# EAGLE design avoccado-avr-pcb (EAGLE 7.2.0)
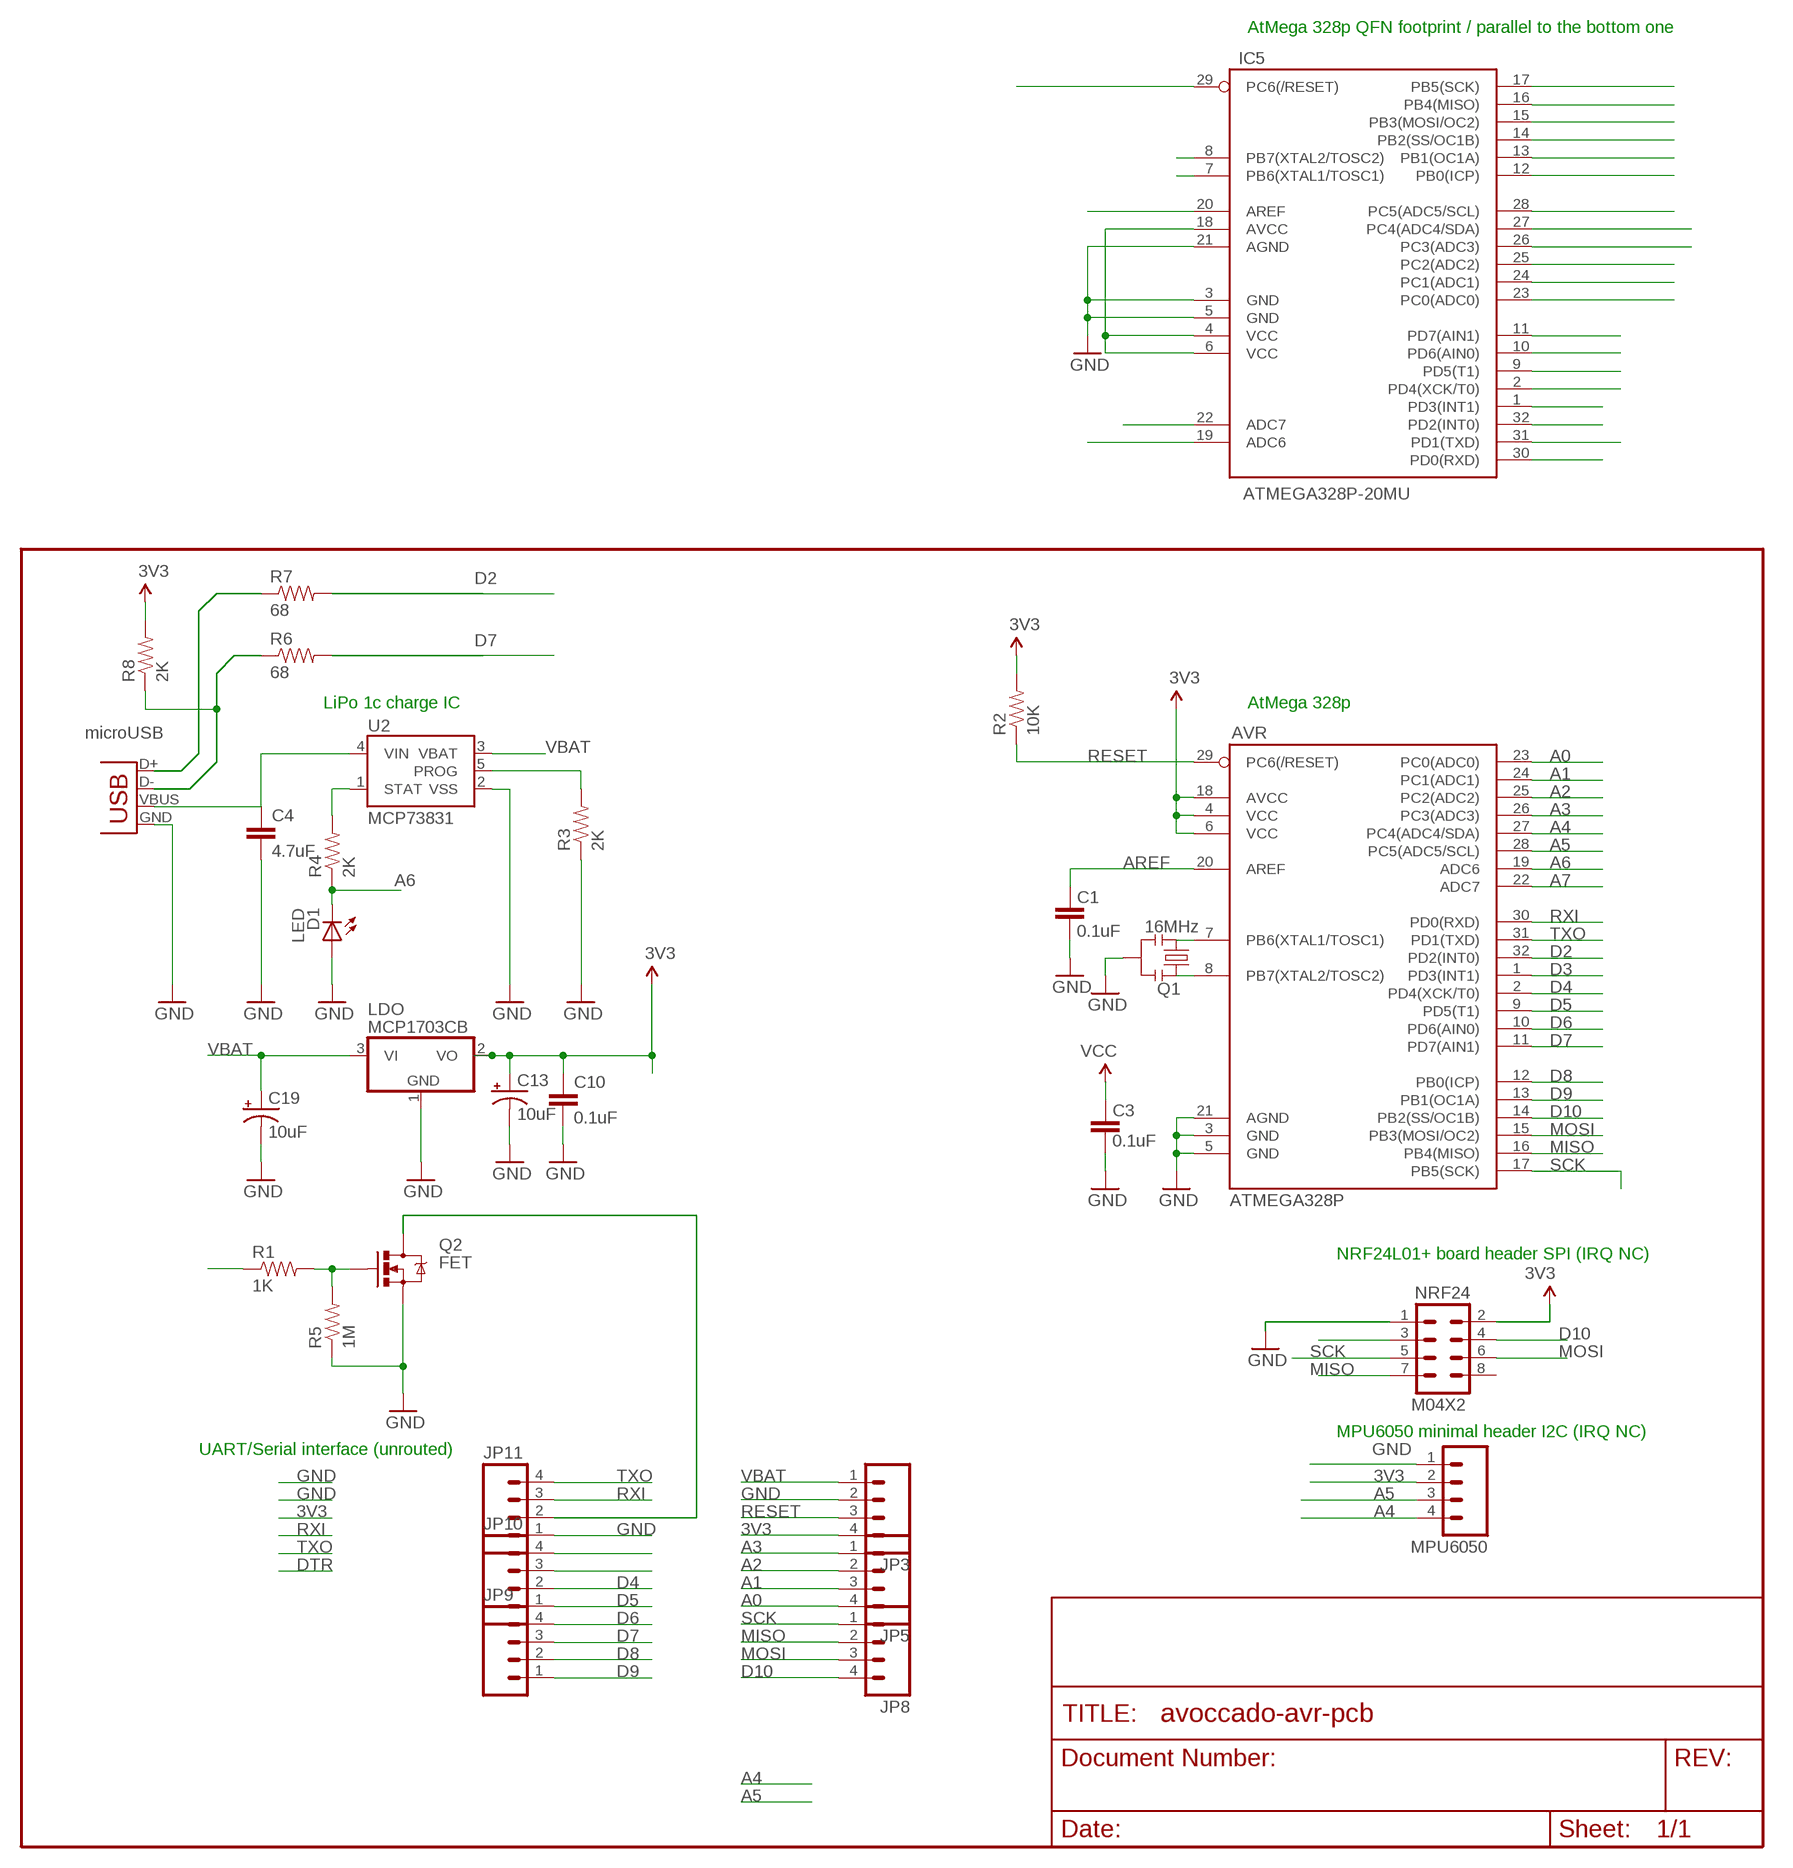
[diagram p0: schematic, sheet 1]

## Parts
AVR  ATMEGA328P  ATMEGA328_SMT  [TQFP32-08]
C1  0.1uF  CAP0402  [C0402]
C3  0.1uF  CAP0402  [C0402]
C4  4.7uF  4.7UF-6.3V-10%(0603)0603  [0603-CAP]
C10  0.1uF  CAP0402  [C0402]
C13  10uF  CAP_POL1206  [EIA3216]
C19  10uF  CAP_POL1206  [EIA3216]
D1  LED  LED0603  [LED-0603]
IC5  ATMEGA328P-20MU  MEGA8-MI  [MLF32]
JP3  M04SMD1X4  [1X04-SMD]
JP5  M04SMD1X4  [1X04-SMD]
JP8  M04SMD1X4  [1X04-SMD]
JP9  M04SMD1X4  [1X04-SMD]
JP10  M04SMD1X4  [1X04-SMD]
JP11  M04SMD1X4  [1X04-SMD]
LDO  MCP1703CB  [SOT23]
MPU6050  M041X04_NO_SILK  [1X04_NO_SILK]
NRF24  M04X2  [2X4]
Q1  16MHz  RESONATORSMD  [RESONATOR-SMD]
Q2  FET  MOSFET-NCHANNEL2N7002PW  [SOT323]
R1  1K  RESISTOR0603  [0603-RES]
R2  10K  RESISTOR0603  [0603-RES]
R3  2K  RESISTOR0603  [0603-RES]
R4  2K  RESISTOR0603  [0603-RES]
R5  1M  RESISTOR0603  [0603-RES]
R6  68  RESISTOR0603  [0603-RES]
R7  68  RESISTOR0603  [0603-RES]
R8  2K  RESISTOR0603  [0603-RES]
U2  MCP73831  [SOT23-5]
X1  Micro USB  USB-MICROB  [USB-MICROB]

## Nets
3V3: AVR.4(VCC) AVR.6(VCC) AVR.18(AVCC) C3.2 C10.1 C13.A(+) IC5.4(VCC) IC5.6(VCC) IC5.18(AVCC) JP3.4 LDO.2(VO) MPU6050.2 NRF24.2 R2.2 R8.2 ; supply symbol labelled VCC
A0: AVR.23(PC0(ADC0)) IC5.23(PC0(ADC0)) JP5.4
A1: AVR.24(PC1(ADC1)) IC5.24(PC1(ADC1)) JP5.3
A2: AVR.25(PC2(ADC2)) IC5.25(PC2(ADC2)) JP5.2
A3: AVR.26(PC3(ADC3)) IC5.26(PC3(ADC3)) JP5.1
A4: AVR.27(PC4(ADC4/SDA)) IC5.27(PC4(ADC4/SDA)) MPU6050.4
A5: AVR.28(PC5(ADC5/SCL)) IC5.28(PC5(ADC5/SCL)) MPU6050.3
A6: AVR.19(ADC6) D1.C IC5.19(ADC6) R4.1
A7: AVR.22(ADC7) IC5.22(ADC7)
AREF: AVR.20(AREF) C1.2 IC5.20(AREF)
BUS: C4.1 U2.4(VIN) X1.VBUS
D2: AVR.32(PD2(INT0)) IC5.32(PD2(INT0)) R7.2
D3: AVR.1(PD3(INT1)) IC5.1(PD3(INT1)) R1.1
D4: AVR.2(PD4(XCK/T0)) IC5.2(PD4(XCK/T0)) JP10.2
D5: AVR.9(PD5(T1)) IC5.9(PD5(T1)) JP10.1
D6: AVR.10(PD6(AIN0)) IC5.10(PD6(AIN0)) JP9.4
D7: AVR.11(PD7(AIN1)) IC5.11(PD7(AIN1)) JP9.3 R6.2
D8: AVR.12(PB0(ICP)) IC5.12(PB0(ICP)) JP9.2
D9: AVR.13(PB1(OC1A)) IC5.13(PB1(OC1A)) JP9.1 NRF24.3
D10: AVR.14(PB2(SS/OC1B)) IC5.14(PB2(SS/OC1B)) JP8.4 NRF24.4
GND [vcc]: AVR.3(GND) AVR.5(GND) AVR.21(AGND) C1.1 C3.1 C4.2 C10.2 C13.C(-) C19.C(-) D1.A IC5.3(GND) IC5.5(GND) IC5.21(AGND) JP3.2 JP10.3 JP10.4 JP11.1 LDO.1(GND) MPU6050.1 NRF24.1 Q1.2 Q2.2(S) R3.1 R5.1 U2.2(VSS) X1.GND
MISO: AVR.16(PB4(MISO)) IC5.16(PB4(MISO)) JP8.2 NRF24.7
MOSI: AVR.15(PB3(MOSI/OC2)) IC5.15(PB3(MOSI/OC2)) JP8.3 NRF24.6
N$1: AVR.8(PB7(XTAL2/TOSC2)) IC5.8(PB7(XTAL2/TOSC2)) Q1.1
N$2: AVR.7(PB6(XTAL1/TOSC1)) IC5.7(PB6(XTAL1/TOSC1)) Q1.3
N$3: R3.2 U2.5(PROG)
N$4: R4.2 U2.1(STAT)
N$6: Q2.1(G) R1.2 R5.2
RESET: AVR.29(PC6(/RESET)) IC5.29(PC6(/RESET)) JP3.3 R2.1
RXI: AVR.30(PD0(RXD)) IC5.30(PD0(RXD)) JP11.3
SCK: AVR.17(PB5(SCK)) IC5.17(PB5(SCK)) JP8.1 NRF24.5
TXO: AVR.31(PD1(TXD)) IC5.31(PD1(TXD)) JP11.4
USB-D+: R7.1 X1.D+
USB-D-: R6.1 R8.1 X1.D-
VBAT [vcc]: C19.A(+) JP3.1 LDO.3(VI) U2.3(VBAT)
VIBR: JP11.2 Q2.3(D)
Unconnected: NRF24.8

## Notes on the sheet
- AtMega 328p QFN footprint / parallel to the bottom one
- LiPo 1c charge IC | AtMega 328p
- microUSB
- NRF24L01+ board header SPI (IRQ NC)
- MPU6050 minimal header I2C (IRQ NC)
- UART/Serial interface (unrouted)

## Library data of the parts
AVR = SparkFun-DigitalIC:ATMEGA328_SMT: 32-Pin Atmega328 part Commonly used on Arduino compatible boards Available in QFP and QFN packages TQFP is IC-09069 QFN is non-stock; PROD_ID: IC-09069
C1 C3 C10 = SparkFun:CAP: Capacitor Standard 0603 ceramic capacitor, and 0.1" leaded capacitor.
C4 = SparkFun-Capacitors:4.7UF-6.3V-10%(0603): CAP-08280; PROD_ID: CAP-08280
C13 C19 = SparkFun:CAP_POL: Capacitor Polarized These are standard SMD and PTH capacitors. Normally 10uF, 47uF, and 100uF in electrolytic and tantalum varieties. Always verify the external diameter of the through hole cap, it varies with capacity, voltage, and manufacturer. The EIA devices should be standard.
D1 = SparkFun:LED: LEDs Standard schematic elements and footprints for 5mm, 3mm, 1206, and 0603 sized LEDs. 5mm - Spark Fun Electronics SKU : COM-00529 (and others)
IC5 = idii:MEGA8: MICROCONTROLLER 8 Kbytes FLASH 1 kbytes SRAM 512 bytes EEPROM USART 6-channel 10 bit ADC 2-channel 8 bit ADC Source: avr.lbr
JP3 JP5 JP8-JP11 = smd-pads:M04: Header 4 Standard 4-pin 0.1" header. Use with straight break away headers (SKU : PRT-00116), right angle break away headers (PRT-00553), swiss pins (PRT-00743), machine pins (PRT-00117), and female headers (PRT-00115). Molex polarized connector foot print use with SKU : PRT-08231 with associated crimp pins and housings. 1MM SMD Version SKU: PRT-10208
LDO = linear:MCP1703: 250 mA, 16V, Low Quiescent Current LDO Regulator Source: http://ww1.microchip.com/downloads/en/DeviceDoc/22049b.pdf
MPU6050 = SparkFun-Connectors:M04: Header 4 Standard 4-pin 0.1" header. Use with straight break away headers (SKU : PRT-00116), right angle break away headers (PRT-00553), swiss pins (PRT-00743), machine pins (PRT-00117), and female headers (PRT-00115). Molex polarized connector foot print use with SKU : PRT-08231 with associated crimp pins and housings. 1MM SMD Version SKU: PRT-10208
NRF24 = SparkFun-Connectors:M04X2: .1" header, two rows of four.
Q1 = SparkFun:RESONATOR: Resonator Small SMD resonator. This is the itty bitty 10/20MHz resonators with built in caps. CSTCE10M0G55 and CSTCE20M0V53. Footprint has been reviewed closely but hasn't been tested yet.
Q2 = SparkFun-DiscreteSemi:MOSFET-NCHANNEL: Common NMOSFET Parts MFG P/N Store ID Prod ID FDD8780 TRANS-09984 SI7820DN TRANS-11055 FDS6630A IC-08089 2N7002PW TRANS-11151 FQP30N06L COM-10213 TRANS-10060 BSS123LT1G TRANS-08345 BSS138 TRANS-00830 BS170 2N7000; PROD_ID: TRANS-11151
R1-R8 = SparkFun-Resistors:RESISTOR: Resistor Basic schematic elements and footprints for 0603, 1206, and PTH resistors.
U2 = SparkFun:MCP73831: Microchip's MCP73831 Miniature single cell, fully integrated Li-Ion, Li-polymer charge management controller http://ww1.microchip.com/downloads/en/DeviceDoc/21984a.pdf
X1 = SparkFun:USB: USB Connectors USB-B-PTH is fully proven SKU : PRT-00139 USB-miniB is fully proven SKU : PRT-00587 USB-A-PCB is untested. USB-A-H is throughly reviewed, but untested. Spark Fun Electronics SKU : PRT-00437 USB-B-SMT is throughly reviewed, but untested. Needs silkscreen touching up. USB-A-S has not been used/tested USB-MB-H has not been used/tested

## Net classes
1 vcc: width 0.254 mm
3 usbvcc: width 0.203 mm, drill 0.61 mm, clearance 0.152 mm

## Board
Avoccado-avr controller
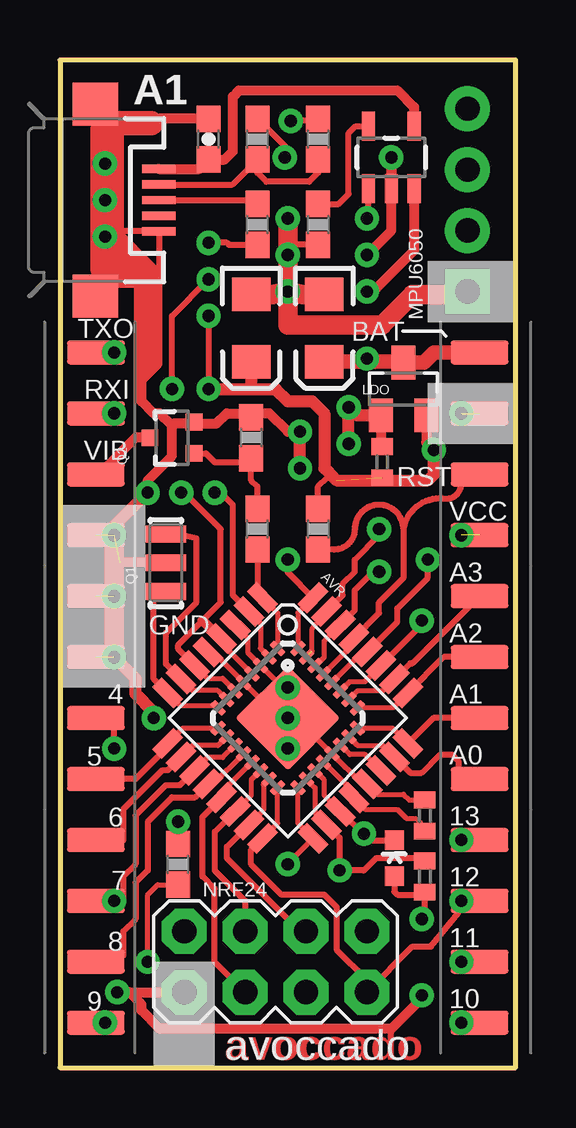
[diagram p1: board, top side]
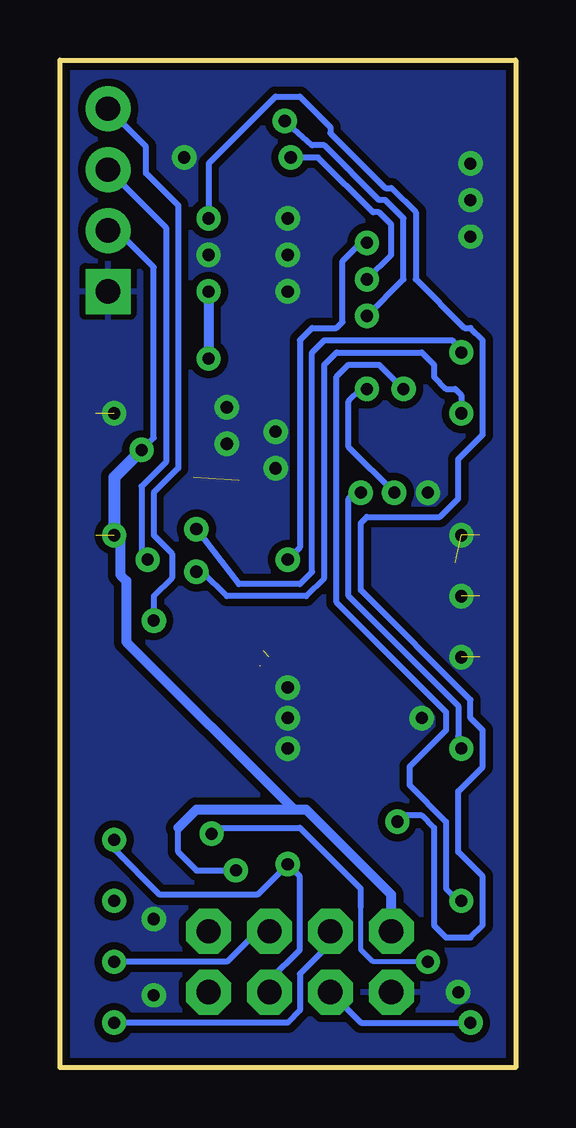
[diagram p2: board, bottom side, seen from below]

Size 19 x 42 mm. Coordinates in mm from the lower left corner, seen from the top.
Outline: 0,42 0,0 19,0 19,42 0,42
Copper layers (1*16): Top 0.035mm / dielectric 1.5mm / Bottom 0.035mm
Design rules "SparkFun-2-layer": minimum track width 7mil, minimum drill 15mil, track to track 8mil, track to pad 8mil, pad to pad 8mil, via to via 8mil, smd to smd 8mil, copper to edge 8mil, drill to drill 8mil, minimum pad ring 12mil, minimum via ring 10mil, stop-mask expansion 4mil, vias tented up to drill 20mil, thermal gap 10mil

### Footprints (pad centres in the part's own frame; a part is rotated, then mirrored left to right if it is on the bottom)
TQFP32-08 = smd 1.27 x 0.559: 1 -4.293,2.8; 2 -4.293,2; 3 -4.293,1.2; 4 -4.293,0.4; 5 -4.293,-0.4; 6 -4.293,-1.2; 7 -4.293,-2; 8 -4.293,-2.8; 17 4.293,-2.8; 18 4.293,-2; 19 4.293,-1.2; 20 4.293,-0.4; 21 4.293,0.4; 22 4.293,1.2; 23 4.293,2; 24 4.293,2.8 | smd 0.559 x 1.27: 9 -2.8,-4.293; 10 -2,-4.293; 11 -1.2,-4.293; 12 -0.4,-4.293; 13 0.4,-4.293; 14 1.2,-4.293; 15 2,-4.293; 16 2.8,-4.293; 25 2.8,4.293; 26 2,4.293; 27 1.2,4.293; 28 0.4,4.293; 29 -0.4,4.293; 30 -1.2,4.293; 31 -2,4.293; 32 -2.8,4.293
C0402 = smd 0.7 x 0.9: 1 -0.65,0; 2 0.65,0
0603-CAP = smd 1.1 x 1: 1 -0.85,0; 2 0.85,0
EIA3216 = smd 1.4 x 1.6: A 1.4,0; C -1.4,0
LED-0603 = smd 0.8 x 0.8: A 0,-0.75; C 0,0.75
MLF32 = smd 0.7 x 0.3: 1 -2.35,1.75; 2 -2.35,1.25; 3 -2.35,0.75; 4 -2.35,0.25; 5 -2.35,-0.25; 6 -2.35,-0.75; 7 -2.35,-1.25; 8 -2.35,-1.75; 17 2.35,-1.75; 18 2.35,-1.25; 19 2.35,-0.75; 20 2.35,-0.25; 21 2.35,0.25; 22 2.35,0.75; 23 2.35,1.25; 24 2.35,1.75 | smd 0.3 x 0.7: 9 -1.75,-2.35; 10 -1.25,-2.35; 11 -0.75,-2.35; 12 -0.25,-2.35; 13 0.25,-2.35; 14 0.75,-2.35; 15 1.25,-2.35; 16 1.75,-2.35; 25 1.75,2.35; 26 1.25,2.35; 27 0.75,2.35; 28 0.25,2.35; 29 -0.25,2.35; 30 -0.75,2.35; 31 -1.25,2.35; 32 -1.75,2.35 | smd 3.1 x 3.1: PAD 0,0
1X04-SMD = smd 1 x 2.4: 1 -3.81,-0.254; 2 -1.27,-0.254; 3 1.27,-0.254; 4 3.81,-0.254
SOT23 = smd 1 x 1.4: 1 -0.95,-1.1; 2 0.95,-1.1; 3 0,1.1
1X04_NO_SILK = drill 1.016 pad 1.88 square: 1 0,0 | drill 1.016 pad 1.88: 2 2.54,0; 3 5.08,0; 4 7.62,0
2X4 = drill 1.016 pad 1.88 octagon: 1 -3.81,-1.27; 2 -3.81,1.27; 3 -1.27,-1.27; 4 -1.27,1.27; 5 1.27,-1.27; 6 1.27,1.27; 7 3.81,-1.27; 8 3.81,1.27
RESONATOR-SMD = smd 0.7 x 1.7: 1 -1.2,0; 2 0,0; 3 1.2,0
SOT323 = smd 0.7 x 0.7: 1 -0.65,-0.925; 2 0.65,-0.925; 3 0,0.925
0603-RES = smd 1.1 x 1: 1 -0.85,0; 2 0.85,0
SOT23-5 = smd 0.55 x 1.2: 1 -0.95,-1.3; 2 0,-1.3; 3 0.95,-1.3; 4 0.95,1.3; 5 -0.95,1.3
USB-MICROB = smd 0.35 x 1.4: D+ 0,2.65; D- -0.65,2.65; GND 1.3,2.65; ID 0.65,2.65; VBUS -1.3,2.65 | smd 1.8 x 1.9: MT1 -4,0; MT2 4,0

### Placement (x,y rotation side)
AVR  9.5,14.57 315 top
C1  15.21,10.5 270 top
C3  15.21,7.96 90 top
C4  6.2,38.7 90 top
C10  13.44,25.24 90 top
C13  7.98,30.82 270 top
C19  11.02,30.82 270 top
D1  13.95,8.73 0 top
IC5  9.5,14.57 315 top
JP3  17.75,26 270 top
JP5  17.75,15.84 270 top
JP8  17.75,5.68 270 top
JP9  1.25,5.68 90 top
JP10  1.25,15.84 90 top
JP11  1.25,26 90 top
LDO  14.33,28.28 0 top
MPU6050  16.99,32.35 90 top
NRF24  8.99,4.41 0 top
Q1  4.42,21.05 90 top
Q2  4.67,26.25 90 top
R1  8.23,22.44 90 top
R2  10.77,22.44 90 top
R3  10.77,35.14 90 top
R4  4.93,8.47 90 top
R5  7.98,26.25 270 top
R6  8.23,38.7 90 top
R7  8.23,35.14 270 top
R8  10.77,38.7 90 top
U2  13.82,37.94 0 top
X1  1.48,36.16 270 top

### Tracks (layer width: path | path; a pad name or v marks a point on that pad's centre or on a via)
3V3  (via drill 0.51 pad 1.02)  (2 unrouted)
  Top 0.203: AVR.18 10.64,10.6 10.64,11.66 IC5.18 | AVR.4 6.75,17.67 IC5.4 | AVR.6 6.15,16.22 6.79,16.22 IC5.6
  Top 0.254: 6.71,17.87 6.72,17.89 AVR.4 | 15.34,25.74 v15.6,25.74 | R8.2 10.68,39.46 v9.63,39.46 | AVR.6 4.93,17.44 4.93,17.62 5.94,18.63 6.71,19.39 6.71,22.44 5.18,23.97 v5.05,23.97 | 6.33,28.28 v6.2,28.28 v6.2,31.33 | C3.2 14.95,8.6 14.82,8.73 13.18,8.73 12.68,8.22 v11.66,8.22 11.66,9.58 AVR.18 | R2.2 10.77,24.22 11.15,24.6 11.4,24.6
  Top 0.406: LDO.2 15.28,26.06 v15.6,25.74 | 5.94,18.63 6.69,17.89 AVR.4
  Top 0.508: C13.A 7.98,28.28 | 7.98,28.28 8.99,28.28 9.5,27.78 10.52,27.78 11.02,27.27 11.02,24.98 11.4,24.6 11.53,24.47 15.34,24.47 15.6,24.73 v15.6,25.74 | 6.33,28.28 7.98,28.28 | R2.2 10.94,23.46
  Bottom 0.254: MPU6050.2 16.61,34.89 15.09,33.36 15.09,26.25 v15.6,25.74 | v6.2,31.33 4.67,32.86 4.67,35.4 5.44,36.16 5.69,36.16 7.98,38.44 8.48,38.44 v9.63,39.46 | v6.2,28.28 6.45,28.28 6.96,27.78 6.96,25.87 v5.05,23.97 | 14.07,10 14.07,8.98 13.31,8.22 v11.66,8.22
  Bottom 0.406: NRF24.2 5.18,7.2 8.74,10.76 9.25,10.76 | v16.74,22.19 16.48,21.93 16.48,20.54 16.23,20.28 16.23,17.74 9.25,10.76 | 14.07,10 13.31,10.76 9.25,10.76
  Bottom 0.508: v15.6,25.74 16.74,24.6 v16.74,22.19
A0
  Top 0.203: AVR.23 13.47,13.43 12.41,13.43 IC5.23
  Top 0.254: AVR.23 14.61,12.28 15.09,12.28 15.85,13.04 16.36,13.04 16.61,12.79 16.61,12.03 JP5.4
A1
  Top 0.203: AVR.24 13.88,14.14 IC5.24
  Top 0.254: AVR.24 15.57,14.57 JP5.3
A2
  Top 0.203: AVR.25 13.88,14.99 IC5.25
  Top 0.254: AVR.25 16,17.11 JP5.2
A3
  Top 0.203: AVR.26 13.47,15.71 12.41,15.71 IC5.26
  Top 0.254: AVR.26 14.61,16.85 14.71,16.85 17.12,19.27 17.24,19.27 arc45 17.47,19.36 JP5.1
A4  (via drill 0.51 pad 1.02)
  Top 0.203: AVR.27 12.72,16.09 12.09,16.09 IC5.27
  Top 0.254: AVR.27 15.09,18.46 v15.09,18.63
  Bottom 0.254: v15.09,18.63 15.09,19.65 14.33,20.41 14.33,21.43 15.09,22.19 15.09,23.97 14.07,24.98 14.07,35.94 15.41,37.28 15.41,38.38 MPU6050.4
A5  (via drill 0.51 pad 1.02)
  Top 0.203: AVR.28 12.61,17.32 IC5.28
  Top 0.254: AVR.28 14.07,18.57 14.07,19.14 15.34,20.41 v15.34,21.17
  Bottom 0.254: v15.34,21.17 15.6,21.43 15.6,24.22 14.58,25.24 14.58,35.02 MPU6050.3
A6  (via drill 0.51 pad 1.02)
  Top 0.203: AVR.19 11.02,11.35 11.02,11.98 IC5.19 | R4.1 4.08,7.62 3.66,7.2 v3.66,4.41
  Top 0.254: AVR.19 12.63,9.74 v12.68,9.74 12.94,9.48 D1.C
  Bottom 0.203: v3.66,4.41 5.94,4.41 6.45,4.92 6.45,6.69
  Bottom 0.254: 6.45,6.69 6.45,7.46 8.99,10 12.42,10 v12.68,9.74
A7
  Top 0.203: AVR.22 12.72,13.04 12.09,13.04 IC5.22
AREF
  Top 0.203: IC5.20 12.25,11.46 AVR.20 12.74,10.76 14.07,10.76 14.45,10.38 14.83,10.38 15.21,10 C1.2
BUS
  Top 0.406: U2.4 14.77,40.03 14.07,40.73 7.47,40.73 7.21,40.48 7.21,38.19 6.87,37.85 C4.1 5.81,37.46 X1.VBUS
D2  (via drill 0.51 pad 1.02)
  Top 0.203: AVR.32 9.92,18.95 IC5.32
  Top 0.254: AVR.32 9.5,20.64 v9.5,21.17 | R7.2 7.05,34.29 6.96,34.38 v6.2,34.38
  Bottom 0.254: v9.5,21.17 8.99,21.68 8.99,30.32 8.48,30.82 7.47,30.82 7.21,31.08 7.21,33.62 6.45,34.38 v6.2,34.38
D3
  Top 0.203: AVR.1 9.08,18.95 IC5.1
  Top 0.254: R1.1 8.23,19.8 AVR.1
D4  (via drill 0.51, 0.51 pad 1.02)
  Top 0.203: AVR.2 8.36,18.54 8.36,17.48 IC5.2 | JP10.2 1.88,14.57
  Top 0.254: AVR.2 7.21,19.68 7.21,23.46 6.71,23.97 v6.45,23.97 | v2.26,13.3 2.26,14.19 1.88,14.57
  Bottom 0.254: v2.26,13.3 2.39,13.81 2.39,15.08 6.96,19.65 6.96,23.71 6.71,23.97 v6.45,23.97
D5
  Top 0.203: AVR.9 5.12,14.14 IC5.9
  Top 0.254: AVR.9 4.49,13.36 3.15,12.03 JP10.1
D6
  Top 0.203: AVR.10 5.53,13.43 6.59,13.43 IC5.10
  Top 0.254: 1.88,9.74 1.5,9.74 JP9.4 2.64,9.49 2.64,10.76 4.29,12.4 4.51,12.4 AVR.10
D7  (via drill 0.51 pad 1.02)
  Top 0.203: AVR.11 6.15,12.92 6.79,12.92 IC5.11
  Top 0.254: JP9.3 v2.26,6.95 2.64,6.95 2.64,7.96 3.15,8.47 3.15,10.5 4.42,11.77 5.01,11.77 AVR.11 | R6.2 9.5,38.28 v9.37,37.94 | v4.67,28.28 4.67,31.33 v6.2,32.86
  Bottom 0.254: v4.67,28.28 5.69,29.3 6.96,29.3 7.47,28.79 7.47,19.39 2.9,14.82 2.9,14.06 4.42,12.54 4.42,11.77 2.9,10.25 2.9,7.46 2.39,6.95 v2.26,6.95 | v6.2,32.86 5.18,33.87 5.18,35.14 5.69,35.65 5.94,35.65 8.23,37.94 v9.37,37.94
D8
  Top 0.203: AVR.12 6.39,11.82 IC5.12
  Top 0.254: JP9.2 1.5,4.66 2.64,4.66 2.64,5.68 3.15,6.19 3.15,7.71 3.66,8.22 3.66,10.25 4.67,11.27 5.63,11.27 AVR.12
D9  (via drill 0.51 pad 1.02)
  Top 0.203: AVR.13 6.75,11.46 IC5.13
  Top 0.254: NRF24.3 6.45,4.41 6.45,7.46 5.94,7.96 5.94,10.45 AVR.13 | v1.88,1.87 JP9.1
  Bottom 0.254: NRF24.3 6.45,1.87 v1.88,1.87
D10  (via drill 0.51)
  Top 0.203: AVR.14 7.98,11.35 7.98,11.98 IC5.14
  Top 0.254: v16.74,1.87 JP8.4 | AVR.14 6.45,9.82 6.45,8.22 7.72,6.95 NRF24.4
  Bottom 0.254: v16.74,1.87 9.5,1.87 8.99,2.38 8.99,3.9 7.72,5.17 NRF24.4
GND  (via drill 0.51, 0.51 pad 1.02)  (5 unrouted)
  Top 0.203: AVR.5 6.39,17.32 IC5.5 8.79,14.92 9.5,14.92 | AVR.3 7.85,17.92 7.85,17.28 IC5.3 9.5,15.63 9.5,15.58 9.5,14.92 | 9.5,14.92 IC5.21 12.61,11.82 AVR.21 13.24,11.39 14.33,11.39 14.56,11.15 C1.1
  Top 0.254: 5.65,26.85 Q2.2 | 9.59,33.78 v9.5,33.87 | R3.1 9.59,34.29 9.5,34.38 | C3.1 14.83,7.19 | 9.5,15.58 v9.5,15.84 | v15.09,6.19 15.21,6.31 C3.1 | D1.A 13.95,7.33 14.07,7.2 15.1,7.2 C3.1 | v1.88,34.63 2.1,34.86 X1.GND 4.13,29.28 3.3,28.45
  Top 0.406: U2.2 v13.82,37.94 13.82,34.89 v12.8,33.87 | LDO.1 13.38,25.95 C10.2 | Q1.2 2.52,21.05 | v3.66,23.97 3.66,24.47 4.67,25.49 4.67,26.76 | 4.67,26.76 4.17,27.27 3.91,27.27 3.4,27.78 3.4,28.79 3.66,29.05 | 3.66,29.05 3.66,29.31 | 3.66,29.31 3.66,33.11 3.91,33.11 3.91,29.3 3.66,29.05 | 4.67,26.76 4.76,26.85 5.65,26.85 6.54,26.85 6.96,27.27 7.81,27.27 | 7.81,27.27 R5.1 | v10.01,26.51 9.5,26.51 8.74,27.27 7.81,27.27 | v15.09,3.01 15.09,2.88 13.82,1.61 4.17,1.61 3.4,2.38 3.4,2.63 2.9,3.14 v2.39,3.14 NRF24.1 | 3.66,29.31 3.3,28.96 3.3,33.02 3.56,33.02 | C4.2 3.73,39.55 3.56,39.37
  Top 0.508: LDO.1 12.38,27.18 v12.04,27.52 v12.04,26 | v3.66,23.97 2.26,22.57 v2.26,22.19 | v10.01,24.98 v10.01,26.51 | v3.91,14.57 3.91,14.82 3.15,15.58 3.15,16.22 v2.26,17.11
  Top 0.813: v9.5,35.4 9.5,34.38 v9.5,33.87 v9.5,32.35 | C19.C 10.13,32.22 v9.5,32.35 | C13.C 8.87,32.22 v9.5,32.35 | v2.26,17.11 v2.26,19.65 v2.26,22.19 | 17.12,32.22 14.71,32.22 13.44,30.95 9.5,30.95 v9.5,32.35
  Top 1.016: 3.56,33.02 2.03,33.02 1.78,33.27 1.78,39.12 2.03,39.37 2.29,39.37 | 3.81,39.37 3.56,39.37 2.29,39.37 | 2.29,39.37 2.03,39.12
  Top 1.27: 2.03,39.12 2.03,34.54 3.56,33.02
  other vias: 9.5,14.57 9.5,13.3 1.88,36.16 1.88,37.68 16.74,27.27
  pour Bottom (isolate 0.305): 0,42 19,42 19,0 0,0
MISO  (via drill 0.51 pad 1.02)
  Top 0.203: AVR.16 9.08,10.18 IC5.16
  Top 0.254: v16.74,6.95 16.61,6.95 16.61,6.44 15.47,5.04 14.71,5.04 NRF24.7 12.8,3.65 11.53,4.92 11.53,6.69 11.02,7.2 9.25,7.2 7.98,8.47 7.98,9.08 AVR.16 8.45,9.53 | 17.63,6.95 JP8.2
  Top 0.508: 17.63,6.95 v16.74,6.95
MOSI  (via drill 0.51 pad 1.02)
  Top 0.203: AVR.15 8.48,10.72 8.48,11.78 IC5.15
  Top 0.254: 7.84,10.12 AVR.15 6.96,9.2 6.96,8.73 10.01,5.68 NRF24.6 | v16.74,4.41 JP8.3
  Bottom 0.254: NRF24.6 10.77,5.68 12.04,4.41 v16.74,4.41
N$1
  Top 0.203: AVR.8 5.03,15.08 6.52,15.08 IC5.8
  Top 0.254: AVR.8 3.91,16.2 3.91,19.65 4.11,19.84 Q1.1
N$2
  Top 0.203: IC5.7 6.59,15.71 5.53,15.71 AVR.7
  Top 0.254: AVR.7 4.42,16.82 4.42,18.12 5.69,19.39 5.69,22.06 4.87,22.25 Q1.3
N$3
  Top 0.254: R3.2 11.62,35.99 12.04,36.41 12.04,38.95 12.32,39.24 U2.5
N$4  (via drill 0.51 pad 1.02)
  Top 0.254: v4.93,10.25 R4.2 | v12.8,35.4 12.87,35.46 U2.1
  Bottom 0.254: v4.93,10.25 4.67,10.5 3.91,10.5 3.4,10 3.4,5.93 2.9,5.42 1.88,5.42 1.37,5.93 1.37,7.96 2.39,8.98 2.39,11.52 1.37,12.54 1.37,14.06 1.88,14.57 1.88,15.33 6.45,19.9 6.45,22.7 6.2,22.95 3.15,22.95 2.39,23.71 2.39,25.36 1.37,26.38 1.37,30.32 1.88,30.82 2.13,30.82 4.17,32.86 4.17,35.65 5.18,36.67 5.44,36.67 7.72,38.95 7.72,39.21 8.99,40.48 10.01,40.48 12.8,37.68 v12.8,35.4
N$6
  Top 0.254: Q2.1 6.09,25.6 6.45,25.24 7.81,25.24 R5.2 7.98,24.47 8.23,24.22 R1.2
RESET
  Top 0.203: AVR.29 12.25,17.67 IC5.29
  Top 0.254: JP3.3 16.74,24.73 16.74,24.35 arc-90 16.1,23.71 arc90 14.33,22.44 | AVR.29 13.31,18.94 13.31,19.39 14.33,20.41 14.33,22.44 | 14.33,22.44 arc180 12.29,22.44 arc-90 11.44,21.59 R2.1
RXI  (via drill 0.51)  (1 unrouted)
  Top 0.203: 10.68,16.76 11.02,17.11 11.02,17.79 AVR.30
  Top 0.254: AVR.30 12.29,19.06 12.29,19.9 13.06,20.66 v13.31,20.66 | v2.26,27.27 JP11.3
  Bottom 0.254: v13.31,20.66 13.06,20.66 12.04,19.65 8.74,19.65 7.98,20.41 7.98,29.3 7.47,29.81 3.91,29.81 3.4,29.3 3.4,28.79 2.9,28.28 2.52,28.28 2.26,28.03 v2.26,27.27
SCK  (via drill 0.51, 0.51 pad 1.02)
  Top 0.203: IC5.17 9.92,10.18 AVR.17 9.75,8.75 v9.5,8.47
  Top 0.254: v16.74,9.49 JP8.1
  Bottom 0.254: NRF24.5 10.26,3.65 8.99,4.92 8.99,7.96 v9.5,8.47 10.77,7.2 14.83,7.2 16.74,9.11 v16.74,9.49
TXO  (via drill 0.51)  (1 unrouted)
  Top 0.203: 10.52,17.36 10.52,18.29 AVR.31
  Top 0.254: AVR.31 11.79,19.68 11.79,20.16 12.29,20.66 12.29,21.17 13.31,22.19 v13.31,22.44 | v2.26,29.81 JP11.4
  Bottom 0.254: v2.26,29.81 2.64,30.32 7.98,30.32 8.48,29.81 8.48,20.66 8.99,20.16 11.53,20.16 v13.31,22.44
USB-D+
  Top 0.254: X1.D+ 8.06,36.16 R7.1
USB-D-
  Top 0.254: X1.D- 7.19,36.81 R6.1 8.23,37.3 8.61,36.92 10.39,36.92 10.77,37.3 R8.1
VBAT  (via drill 0.51 pad 1.02)
  Top 0.406: 16.1,29.81 JP3.1 | U2.3 14.77,34.06 13.06,32.35 v12.8,32.35
  Top 0.508: 14.29,29.42 12.93,29.42 v12.8,29.55
  Top 0.61: C19.A 14.29,29.42 LDO.3 15.17,29.38 15.6,29.81 JP3.1
  Bottom 0.406: v12.8,32.35 v12.8,29.55
VIBR
  Top 0.406: 1.37,24.73 JP11.2 1.63,24.73 3.15,26.25 Q2.3

### Text on the board
Top: avoccado
tPlace: A1 | TXO | BAT | RXI | VIB | RST | VCC | A3 | GND | A2 | 4 | A1 | 5 | A0 | 6 | 13 | 12 | 7 | 8 | 11 | 9 | 10 | avoccado